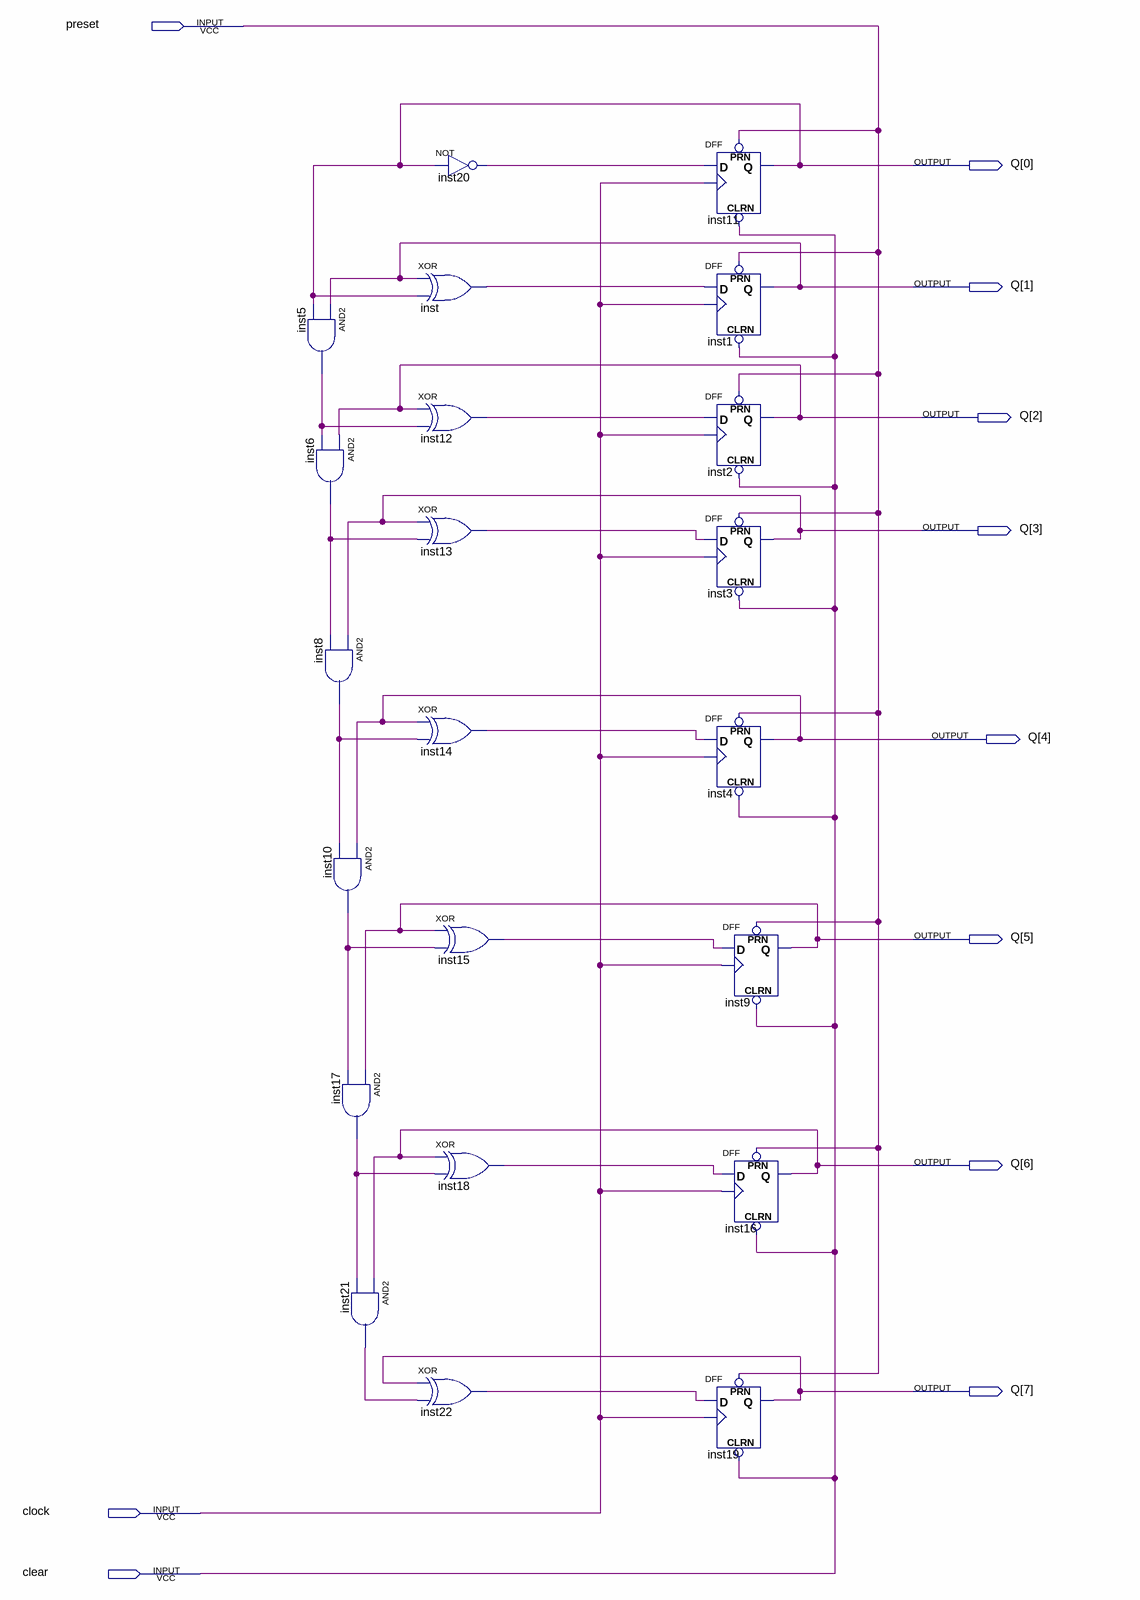
[diagram p0: schematic sheet]
// Quartus schematic contador.bdf as structural Verilog: 22 symbols, 11 pins
module contador (
  input  preset,
  input  clock,
  input  clear,
  output [7:0] Q
);

  wire inst5_out, inst6_out, inst8_out, inst10_out, inst12_out, inst13_out, inst14_out, inst15_out,
       inst17_out, inst18_out, inst20_out, inst21_out, inst22_out, inst_out;

  and inst5 (inst5_out, Q[1], Q[0]);
  and inst6 (inst6_out, Q[2], inst5_out);
  and inst8 (inst8_out, Q[3], inst6_out);
  and inst10 (inst10_out, Q[4], inst8_out);
  and inst17 (inst17_out, Q[5], inst10_out);
  and inst21 (inst21_out, Q[6], inst17_out);
  not inst20 (inst20_out, Q[0]);
  xor inst (inst_out, Q[1], Q[0]);
  xor inst12 (inst12_out, Q[2], inst5_out);
  xor inst13 (inst13_out, Q[3], inst6_out);
  xor inst14 (inst14_out, Q[4], inst8_out);
  xor inst15 (inst15_out, Q[5], inst10_out);
  xor inst18 (inst18_out, Q[6], inst17_out);
  xor inst22 (inst22_out, Q[7], inst21_out);
  DFF inst11 (.CLRN(clear), .CLK(clock), .D(inst20_out), .PRN(preset), .Q(Q[0]));
  DFF inst1 (.CLRN(clear), .CLK(clock), .D(inst_out), .PRN(preset), .Q(Q[1]));
  DFF inst2 (.CLRN(clear), .CLK(clock), .D(inst12_out), .PRN(preset), .Q(Q[2]));
  DFF inst3 (.CLRN(clear), .CLK(clock), .D(inst13_out), .PRN(preset), .Q(Q[3]));
  DFF inst4 (.CLRN(clear), .CLK(clock), .D(inst14_out), .PRN(preset), .Q(Q[4]));
  DFF inst19 (.CLRN(clear), .CLK(clock), .D(inst22_out), .PRN(preset), .Q(Q[7]));
  DFF inst9 (.CLRN(clear), .CLK(clock), .D(inst15_out), .PRN(preset), .Q(Q[5]));
  DFF inst16 (.CLRN(clear), .CLK(clock), .D(inst18_out), .PRN(preset), .Q(Q[6]));
endmodule
